# Altium schematic sheet F103H.SchDoc
size A4
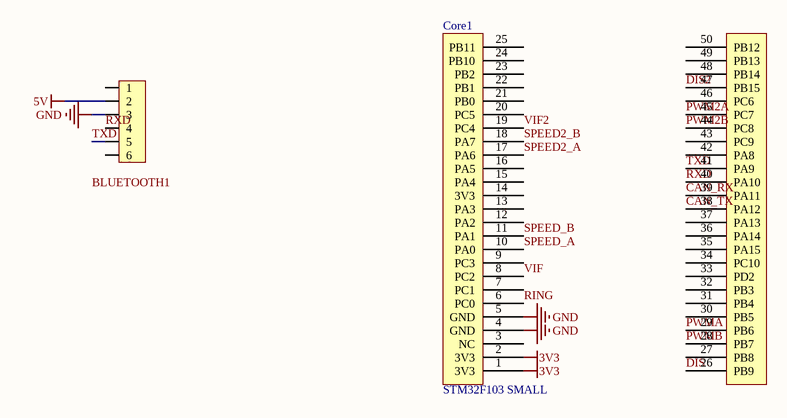
[diagram p0: F103H.SchDoc]

## Parts
BLUETOOTH1  HDR1x6_2.54  [HDR1X6_2.54_180]  (value not drawn)
Core1  STM32F103 SMALL  [STM32F103Small]

## Nets
3V3: Core1.1(3V3) Core1.2(3V3)
5V: BLUETOOTH1.2
GND: BLUETOOTH1.3 Core1.4(GND) Core1.5(GND)
CAN_RX: Core1.39(PA11)
CAN_TX: Core1.38(PA12)
DIS: Core1.26(PB9)
DIS2: Core1.47(PB15)
PWM2A: Core1.45(PC7)
PWM2B: Core1.44(PC8)
PWMA: Core1.29(PB6)
PWMB: Core1.28(PB7)
RING: Core1.6(PC0)
RXD: BLUETOOTH1.4 Core1.40(PA10)
SPEED2_A: Core1.17(PA6)
SPEED2_B: Core1.18(PA7)
SPEED_A: Core1.10(PA0)
SPEED_B: Core1.11(PA1)
TXD: BLUETOOTH1.5 Core1.41(PA9)
VIF: Core1.8(PC2)
VIF2: Core1.19(PC4)

Not connected (* = marked no-connect by the designer): BLUETOOTH1 1 6; Core1 3(NC) 7(PC1) 9(PC3) 12(PA2) 13(PA3) 14(3V3) 15(PA4) 16(PA5) 20(PC5) 21(PB0) 22(PB1) 23(PB2) 24(PB10) 25(PB11) 27(PB8) 30(PB5) 31(PB4) 32(PB3) 33(PD2) 34(PC10) 35(PA15) 36(PA14) 37(PA13) 42(PA8) 43(PC9) 46(PC6) 48(PB14) 49(PB13) 50(PB12)

## Library data of the parts
BLUETOOTH1 = HDR1x6_2.54: Header